# Altium schematic sheet STM32.SchDoc
size A; SheetNumber: 3; SheetTotal: 5
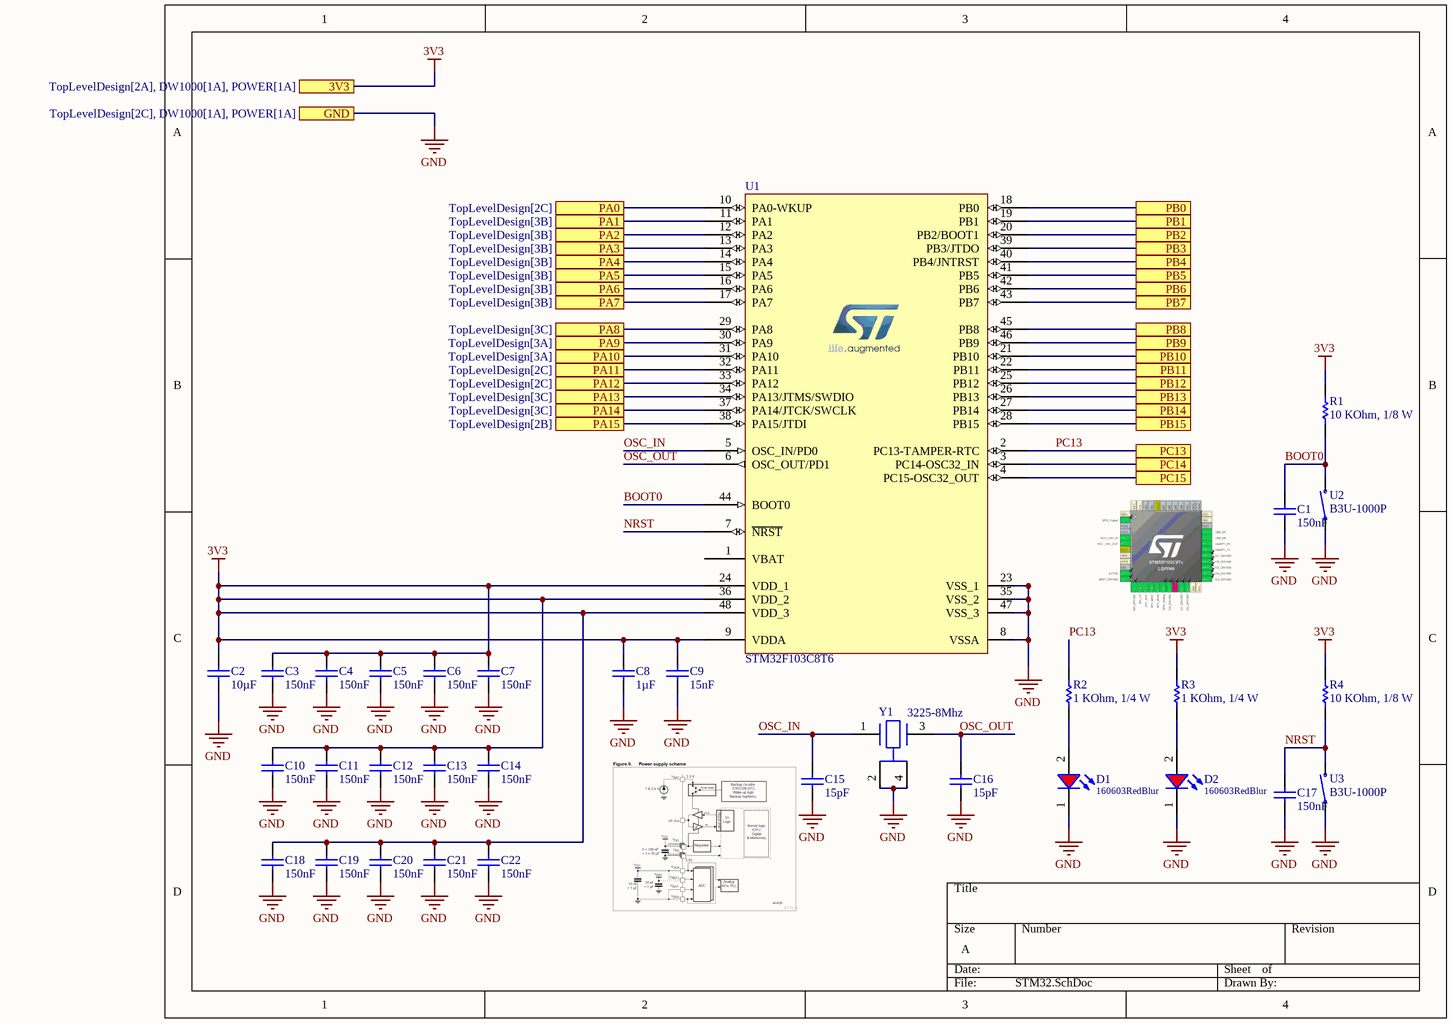
[diagram p0: STM32.SchDoc]

## Parts
C1  value 150nF  [CAP_0805]  (hidden comment: 0108051541050)
C2  value 10µF  [CAP_0805]  (hidden comment: 0108051061016)
C3  value 150nF  [CAP_0805]  (hidden comment: 0108051541050)
C4  value 150nF  [CAP_0805]  (hidden comment: 0108051541050)
C5  value 150nF  [CAP_0805]  (hidden comment: 0108051541050)
C6  value 150nF  [CAP_0805]  (hidden comment: 0108051541050)
C7  value 150nF  [CAP_0805]  (hidden comment: 0108051541050)
C8  value 1µF  [CAP_0805]  (hidden comment: 0108051051016)
C9  value 15nF  [CAP_0805]  (hidden comment: 0108051531050)
C10  value 150nF  [CAP_0805]  (hidden comment: 0108051541050)
C11  value 150nF  [CAP_0805]  (hidden comment: 0108051541050)
C12  value 150nF  [CAP_0805]  (hidden comment: 0108051541050)
C13  value 150nF  [CAP_0805]  (hidden comment: 0108051541050)
C14  value 150nF  [CAP_0805]  (hidden comment: 0108051541050)
C15  value 15pF  [CAP_0603]  (hidden comment: 0106031500550)
C16  value 15pF  [CAP_0603]  (hidden comment: 0106031500550)
C17  value 150nF  [CAP_0805]  (hidden comment: 0108051541050)
C18  value 150nF  [CAP_0805]  (hidden comment: 0108051541050)
C19  value 150nF  [CAP_0805]  (hidden comment: 0108051541050)
C20  value 150nF  [CAP_0805]  (hidden comment: 0108051541050)
C21  value 150nF  [CAP_0805]  (hidden comment: 0108051541050)
C22  value 150nF  [CAP_0805]  (hidden comment: 0108051541050)
D1  160603RedBlur  [WL-SMCW_0603_H=0.7mm]
D2  160603RedBlur  [WL-SMCW_0603_H=0.7mm]
R1  value 10 KOhm, 1/8 W  [RESISTOR_0805]  (hidden comment: 0008051035)
R2  value 1 KOhm, 1/4 W  [resistor_0603]  (hidden comment: 0006031021)
R3  value 1 KOhm, 1/4 W  [resistor_0603]  (hidden comment: 0006031021)
R4  value 10 KOhm, 1/8 W  [RESISTOR_0805]  (hidden comment: 0008051035)
U1  STM32F103C8T6  [STM32F103C8T6]
U2  B3U-1000P  [SODFL4025X160N]
U3  B3U-1000P  [SODFL4025X160N]
Y1  3225-8Mhz  [FP-NX3225SA-MFG]

## Ports
3V3 (see TopLevelDesign[2A], DW1000[1A], POWER[1A]), GND (see TopLevelDesign[2C], DW1000[1A], POWER[1A]), PA0 (see TopLevelDesign[2C]), PA1 (see TopLevelDesign[3B]), PA2 (see TopLevelDesign[3B]), PA3 (see TopLevelDesign[3B]), PA4 (see TopLevelDesign[3B]), PA5 (see TopLevelDesign[3B]), PA6 (see TopLevelDesign[3B]), PA7 (see TopLevelDesign[3B]), PA8 (see TopLevelDesign[3C]), PA9 (see TopLevelDesign[3A]), PA10 (see TopLevelDesign[3A]), PA11 (see TopLevelDesign[2C]), PA12 (see TopLevelDesign[2C]), PA13 (see TopLevelDesign[3C]), PA14 (see TopLevelDesign[3C]), PA15 (see TopLevelDesign[2B]), PB0 (see TopLevelDesign[3B]), PB1 (see TopLevelDesign[3B]), PB2 (see TopLevelDesign[2B]), PB3 (see TopLevelDesign[2B]), PB4 (see TopLevelDesign[2B]), PB5 (see TopLevelDesign[2B]), PB6 (see TopLevelDesign[2B]), PB7 (see TopLevelDesign[2B]), PB8 (see TopLevelDesign[2B]), PB9 (see TopLevelDesign[2B]), PB10 (see TopLevelDesign[3B]), PB11 (see TopLevelDesign[3B]), PB12 (see TopLevelDesign[3B]), PB13 (see TopLevelDesign[3B]), PB14 (see TopLevelDesign[3C]), PB15 (see TopLevelDesign[3C]), PC13 (see TopLevelDesign[2C]), PC14 (see TopLevelDesign[2C]), PC15 (see TopLevelDesign[2C])

## Nets
3V3: C2.2 C3.2 C4.2 C5.2 C6.2 C7.2 C8.2 C9.2 C10.2 C11.2 C12.2 C13.2 C14.2 C18.2 C19.2 C20.2 C21.2 C22.2 R1.2 R3.2 R4.2 U1.9(VDDA) U1.24(VDD_1) U1.36(VDD_2) U1.48(VDD_3) ; port 3V3
GND: C1.2 C2.1 C3.1 C4.1 C5.1 C6.1 C7.1 C8.1 C9.1 C10.1 C11.1 C12.1 C13.1 C14.1 C15.1 C16.1 C17.2 C18.1 C19.1 C20.1 C21.1 C22.1 D1.1(K) D2.1(K) U1.8(VSSA) U1.23(VSS_1) U1.35(VSS_2) U1.47(VSS_3) U2.1 U3.1 Y1.2(GND) Y1.4(GND) ; port GND
BOOT0: C1.1 R1.1 U1.44(BOOT0) U2.2
NRST: C17.1 R4.1 U1.7(~{NRST}) U3.2
OSC_IN: C15.2 U1.5(OSC_IN/PD0) Y1.1
OSC_OUT: C16.2 U1.6(OSC_OUT/PD1) Y1.3
PA0: U1.10(PA0-WKUP) ; port PA0
PA1: U1.11(PA1) ; port PA1
PA2: U1.12(PA2) ; port PA2
PA3: U1.13(PA3) ; port PA3
PA4: U1.14(PA4) ; port PA4
PA5: U1.15(PA5) ; port PA5
PA6: U1.16(PA6) ; port PA6
PA7: U1.17(PA7) ; port PA7
PA8: U1.29(PA8) ; port PA8
PA9: U1.30(PA9) ; port PA9
PA10: U1.31(PA10) ; port PA10
PA11: U1.32(PA11) ; port PA11
PA12: U1.33(PA12) ; port PA12
PA13: U1.34(PA13/JTMS/SWDIO) ; port PA13
PA14: U1.37(PA14/JTCK/SWCLK) ; port PA14
PA15: U1.38(PA15/JTDI) ; port PA15
PB0: U1.18(PB0) ; port PB0
PB1: U1.19(PB1) ; port PB1
PB2: U1.20(PB2/BOOT1) ; port PB2
PB3: U1.39(PB3/JTDO) ; port PB3
PB4: U1.40(PB4/JNTRST) ; port PB4
PB5: U1.41(PB5) ; port PB5
PB6: U1.42(PB6) ; port PB6
PB7: U1.43(PB7) ; port PB7
PB8: U1.45(PB8) ; port PB8
PB9: U1.46(PB9) ; port PB9
PB10: U1.21(PB10) ; port PB10
PB11: U1.22(PB11) ; port PB11
PB12: U1.25(PB12) ; port PB12
PB13: U1.26(PB13) ; port PB13
PB14: U1.27(PB14) ; port PB14
PB15: U1.28(PB15) ; port PB15
PC13: R2.2 U1.2(PC13-TAMPER-RTC) ; port PC13
PC14: U1.3(PC14-OSC32_IN) ; port PC14
PC15: U1.4(PC15-OSC32_OUT) ; port PC15
NetD1_2: D1.2(A) R2.1
NetD2_2: D2.2(A) R3.1

Not connected (* = marked no-connect by the designer): U1 1(VBAT)

## Library data of the parts
C1 C3-C7 C10-C14 C17-C22 = CMP-001-00268-1: CAP, size 0805, 150 nF, 50 VDC; Manufacture Name: TDK; Manufacture SN: CGA4J2X7R1H154K125AD; Tolerance: 10%; Voltage Rating DC: 50 VDC; Mounting Technology: SMT; Supplier 3 SN: OEM; Source: Capacitor_0805_10_percent.SchLib; Supplier 2 URL: https://www.digikey.com/en/products/detail/tdk-corporation/cga4j2x7r1h154k125ad/3933662; Size: 0805; Supplier 2 Name: Digi-Key; Supplier 2 SN: 445-9929-2-ND; Component Type: Standard; Operating Temperature: -55 to +125degC; Supplier 1 URL: https://www.mouser.vn/ProductDetail/TDK/CGA4J2X7R1H154K125AD?qs=xLDY6iXSiQYlxmVq9lRXDA%3D%3D&utm_source=mouser-refine-download&utm_medium=file&utm_campaign=CGA4J2X7R1H154K125AD&utm_content=TDK; Supplier 1 SN: 810-CGA4J2X7R1H154KD; Packaging: Tape and Reel; Supplier 3 URL: N/A; Pins: 2; Design Item ID: 0108051541050; Supplier 3 Name: thegioiic; Supplier 1 Name: Mouser
C2 = CMP-001-00264-1: CAP, size 0805, 10 uF, 16 VDC; Manufacture Name: TDK; Manufacture SN: CGA4J1X7S1C106K125AE; Tolerance: 10%; Voltage Rating DC: 16 VDC; Supplier 1 URL: https://www.mouser.vn/ProductDetail/TDK/CGA4J1X7S1C106K125AE?qs=nQSIdc08i%252Bda5YDbrVYncg%3D%3D&utm_source=mouser-refine-download&utm_medium=file&utm_campaign=CGA4J1X7S1C106K125AE&utm_content=TDK; Supplier 2 URL: https://www.digikey.com/en/products/detail/tdk-corporation/cga4j1x7s1c106k125ae/5809239; Design Item ID: 0108051061016; Supplier 1 SN: 810-CGA4J1X7S1C106KA; Mounting Technology: SMT; Supplier 3 SN: OEM; Pins: 2; Supplier 3 Name: thegioiic; Packaging: Tape and Reel; Size: 0805; Source: Capacitor_0805_10_percent.SchLib; Operating Temperature: -55 to +125degC; Supplier 2 SN: 445-173674-2-ND; Supplier 1 Name: Mouser; Supplier 3 URL: N/A; Supplier 2 Name: Digi-Key; Component Type: Standard
C8 = CMP-001-00260-1: CAP, size 0805, 1 uF, 16 VDC; Manufacture SN: CGA4J2X7R1C105K125AA; Manufacture Name: TDK; Voltage Rating DC: 16 VDC; Tolerance: 10%; Component Type: Standard; Design Item ID: 0108051051016; Supplier 3 URL: N/A; Supplier 1 SN: 810-CGA4J2X7R1C105K; Mounting Technology: SMT; Supplier 2 URL: https://www.digikey.com/en/products/detail/tdk-corporation/cga4j2x7r1c105k125aa/2443167; Source: Capacitor_0805_10_percent.SchLib; Supplier 2 SN: 445-5689-2-ND; Supplier 3 Name: thegioiic; Supplier 1 URL: https://www.mouser.vn/ProductDetail/TDK/CGA4J2X7R1C105K125AA?qs=NRhsANhppD8sFjo%252B1TQuCQ%3D%3D&utm_source=mouser-refine-download&utm_medium=file&utm_campaign=CGA4J2X7R1C105K125AA&utm_content=TDK; Supplier 2 Name: Digi-Key; Supplier 3 SN: OEM; Pins: 2; Packaging: Tape and Reel; Size: 0805; Operating Temperature: -55 to +125degC; Supplier 1 Name: Mouser
C9 = CMP-001-00267-1: CAP, size 0805, 15 nF, 50 VDC; Manufacture Name: TDK; Manufacture SN: CGA4F2NP01H153J085AA; Voltage Rating DC: 50 VDC; Tolerance: 5%; Operating Temperature: -55 to +125degC; Component Type: Standard; Supplier 2 SN: 445-12627-2-ND; Pins: 2; Supplier 2 Name: Digi-Key; Source: Capacitor_0805_5_percent.SchLib; Supplier 2 URL: https://www.digikey.com/en/products/detail/tdk-corporation/cga4f2np01h153j085aa/3949863; Design Item ID: 0108051531050; Size: 0805; Supplier 1 Name: Mouser; Mounting Technology: SMT; Supplier 3 Name: thegioiic; Supplier 3 URL: N/A; Packaging: Tape and Reel; Supplier 1 SN: 810-CGA4F2NP01H153JA; Supplier 3 SN: OEM; Supplier 1 URL: https://www.mouser.vn/ProductDetail/TDK/CGA4F2NP01H153J085AA?qs=xLDY6iXSiQbFHNeB91aULg%3D%3D&utm_source=mouser-refine-download&utm_medium=file&utm_campaign=CGA4F2NP01H153J085AA&utm_content=TDK
C15 C16 = CMP-001-00221-1: CAP, size 0603, 15 pF, 50 VDC; Manufacture SN: CGA3E2NP01H150J080AA; Manufacture Name: TDK; Tolerance: 5%; Voltage Rating DC: 50 VDC; Supplier 2 Name: Digi-Key; Supplier 2 SN: 445-12393-2-ND; Supplier 3 Name: thegioiic; Component Type: Standard; Size: 0603; Mounting Technology: SMT; Supplier 2 URL: https://www.digikey.com/en/products/detail/tdk-corporation/cga3e2np01h150j080aa/3949629; Supplier 1 Name: Mouser; Supplier 3 SN: N/A; Design Item ID: 0106031500550; Source: Capacitor_0603_5_percent.SchLib; Supplier 1 URL: https://www.mouser.com/ProductDetail/TDK/CGA3E2NP01H150J080AA?qs=xLDY6iXSiQaG7IFLqTiW9w%3D%3D&utm_source=mouser-refine-download&utm_medium=file&utm_campaign=CGA3E2NP01H150J080AA&utm_content=TDK; Operating Temperature: -55 to +125degC; Supplier 1 SN: 810-CGA3E2NP01H150JA; Supplier 3 URL: N/A; Packaging: Tape and Reel; Pins: 2
D1 D2 = CMP-004-00093-1: WL-SMCW SMT Mono-color Chip LED Blur, size 0603, Red, 2V, 140deg; Value: Red, 2V; ComponentLink2URL: https://www.mouser.vn/ProductDetail/ROHM-Semiconductor/CSL1901VW1?qs=vvQtp7zwQdNmrXZcE27xEA%3D%3D; Supplier 2 URL: https://www.digikey.com/en/products/detail/rohm-semiconductor/SML-D12U8WT86/1641799; Pins: 2; Supplier 2 Name: Digi-Key; ComponentLink1Description: Datasheet link; ComponentLink3URL: https://www.digikey.com/en/products/detail/rohm-semiconductor/SML-D12U8WT86/1641799; Supplier 1 Name: Mouser; Supplier 1 SN: 755-CSL1901VW1; Size: 0603; ComponentLink1URL: N/A; Source: WL-SMCW_0603.SchLib; ComponentLink3Description: Supplier 2 URL; Type: Blur; Design Item ID: 160603RedBlur; Component Type: Standard; ComponentLink4URL: N/A; Supplier 3 Name: ICDayRoi; Supplier 3 SN: N/A; Color: Red; Supplier 1 URL: https://www.mouser.vn/ProductDetail/ROHM-Semiconductor/CSL1901VW1?qs=vvQtp7zwQdNmrXZcE27xEA%3D%3D; Supplier 2 SN: 511-1580-2-ND; ComponentLink2Description: Supplier 1 URL; Supplier 3 URL: N/A; ComponentLink4Description: Supplier 3 URL
R1 R4 = CMP-009-00424-1: RES, size 0805, 10 KOhm, 1/8 W; Manufacture  SN: CRCW080510K0JNEAC; Manufacture  Name: Vishay Dale; Resistance Tolerance: +/-5%; Rated Power: 1/8 W; ComponentLink4URL: N/A; Supplier 3 SN: N/A; Supplier 1 SN: 71-CRCW080510K0JNEB; Source: Resistor_0805.SchLib; Supplier 3 URL: N/A; Supplier 3 Name: Thegioiic; ComponentLink2Description: Supplier 1 URL; ComponentLink4Description: Supplier 3 URL; Supplier 2 URL: https://www.digikey.com/en/products/detail/vishay-dale/CRCW080510K0JNEAC/7928585; ComponentLink3Description: Supplier 2 URL; Size: 0805; ComponentLink1Description: Datasheet link; Supplier 1 URL: https://www.mouser.vn/ProductDetail/Vishay-Dale/CRCW080510K0JNEB?qs=LOX6nxTstiZ5fn9YUdHx5A%3D%3D; Supplier 1 Name: Mouser; Pins: 2; Design Item ID: 0008051035; Supplier 2 SN: 541-4163-2-ND; Supplier 2 Name: Digi-Key; ComponentLink3URL: https://www.digikey.com/en/products/detail/vishay-dale/CRCW080510K0JNEAC/7928585; Component Type: Standard; ComponentLink2URL: https://www.mouser.vn/ProductDetail/Vishay-Dale/CRCW080510K0JNEB?qs=LOX6nxTstiZ5fn9YUdHx5A%3D%3D; Mounting Technology: SMT; ComponentLink1URL: https://www.vishay.com/docs/28773/crcwce3.pdf
R2 R3 = CMP-009-00186-1: RES, size 0603, 1 KOhm, 1/4 W; Manufacture  SN: OEM; Rated Power: 1/4 W; Resistance Tolerance: +/-1%; Supplier 1 SN: 71-RCS06031K00FKEA; ComponentLink4Description: Supplier 3 URL; ComponentLink2Description: Supplier 1 URL; Supplier 3 SN: N/A; Supplier 2 Name: Digi-Key; ComponentLink3Description: Supplier 2 URL; Pins: 2; ComponentLink4URL: N/A; Source: Resistor_0603.SchLib; ComponentLink3URL: https://www.digikey.com/en/products/detail/yageo/SR0603FR-7T1KL/9373103; Supplier 2 SN: YAG5829TR-ND YAG5829CT-ND YAG5829DKR-ND; Supplier 2 URL: https://www.digikey.com/en/products/detail/yageo/SR0603FR-7T1KL/9373103; Supplier 1 Name: Mouser; Component Type: Standard; ComponentLink2URL: N/A; Size: 0603; Supplier 1 URL: https://www.mouser.vn/ProductDetail/Vishay-Dale/RCS06031K00FKEA?qs=sGAEpiMZZMvdGkrng054t9clqp6gtJJdzI9PGMrTQi4RTIuHToNahw%3D%3D; Supplier 3 URL: N/A; Design Item ID: 0006031021; Mounting Technology: SMT; ComponentLink1URL: https://www.yageo.com/upload/media/product/productsearch/datasheet/rchip/PYu-SR_20105_RoHS_L_10.pdf; ComponentLink1Description: Datasheet link; Supplier 3 Name: thegioiic; Manufacture  Name: OEM
U1 = STM32F103C8T6-000006-1: ARM Microcontrollers - MCU 32BIT Cortex M3 64KB 20KB RAM 2X12 ADC; Manufacture SN: STM32F103C8T6TR; Manufacturer: STM; Pad count: 48; Value: STM32F103C8T6; Pins: 48; ComponentLink1URL: https://www.mouser.com/datasheet/2/389/stm32f103c8-1851025.pdf; Supplier 3 URL: https://www.thegioiic.com/stm32f103c8t6-32-bit-arm-cortex-m3-microcontroller-72mhz-64kb-flash-48-lqfp; Supplier 1 URL: https://www.mouser.com/ProductDetail/STMicroelectronics/STM32F103C8T6?qs=bhCVus9SdFtq6kqxsU5%2FDA%3D%3D; Supplier 1 Name: Mouser; Component Type: Standard; Part Number: STM32F103C8T6; ComponentLink2URL: https://www.mouser.com/ProductDetail/STMicroelectronics/STM32F103C8T6?qs=bhCVus9SdFtq6kqxsU5%2FDA%3D%3D; Source: STM32.SchLib; Supplier 2 URL: https://www.digikey.com/en/products/detail/stmicroelectronics/stm32f103c8t6tr/2122442; Supplier 3 SN: STM32F103C8T6; Supplier 2 SN: 497-17666-2-ND; ComponentLink1Description: Datasheet; Design Item ID: STM32F103C8T6; Supplier 1 SN: 511-STM32F103C8T6; ComponentLink2Description: Supplier 1 URL; Supplier 3 Name: thegioiic; Footprint name: LQFP48; ComponentLink4Description: Supplier 3 URL; ComponentLink3URL: 497-17666-2-ND; ComponentLink3Description: Supplier 2 URL; Supplier 2 Name: Digi-Key; ComponentLink4URL: https://www.thegioiic.com/stm32f103c8t6-32-bit-arm-cortex-m3-microcontroller-72mhz-64kb-flash-48-lqfp
U2 U3 = CMP-011-00123-3: Switch Tactile N.O. SPST Round Button Gull Wing 0.05A 12VDC 1.5N SMD T/R; MP: B3U1000P; MF: Omron; Design Item ID: B3U-1000P; Value: *; Component Type: Standard; Check_prices: https://www.snapeda.com/parts/B3U1000P/Omron/view-part/?ref=eda; SnapEDA_Link: https://www.snapeda.com/parts/B3U1000P/Omron/view-part/?ref=snap; Pins: 2; Case/Package: None; Source: B3U-1000P.SchLib
Y1 = CMP-003-00059-1: CRYSTAL 8MHZ 8PF SMD; Manufacturer: NDK; Manufacturer Part Number: NX3225SA-25.000M-STD-CRS-2; Automotive Grade: Grade 1; Tolerance: 15ppm; Esr: 100; Series: NX3225SA; Device Class L2: Crystals / Oscillators; Temperature Range High: 125°C; Category: Crys; Height: 0.6mm; Device Class L3: Crystals; Device Class L1: Passive Components; Load Capacitance: 8pF; Octopart: https://octopart.com/nx3225sa-25.000m-std-crs-2-ndk-51374293; Automotive: Yes; Temperature: -40°C to +125°C; Component Type: Standard; Source: Components - 28.03.25 - 23.15.SchLib; Digikey Description: CRYSTAL 40MHZ 8PF SMD; Design Item ID: CMP-200220-000002-1; Temperature Range Low: -40°C; Frequency: 8MHz; Case/Package: NX3225SA; RoHS: TRUE; Pins: 4; Lead Free: Yes